# EAGLE design Sifteo Thundercracker Buddy Dev - 0.2 (EAGLE 5.11)
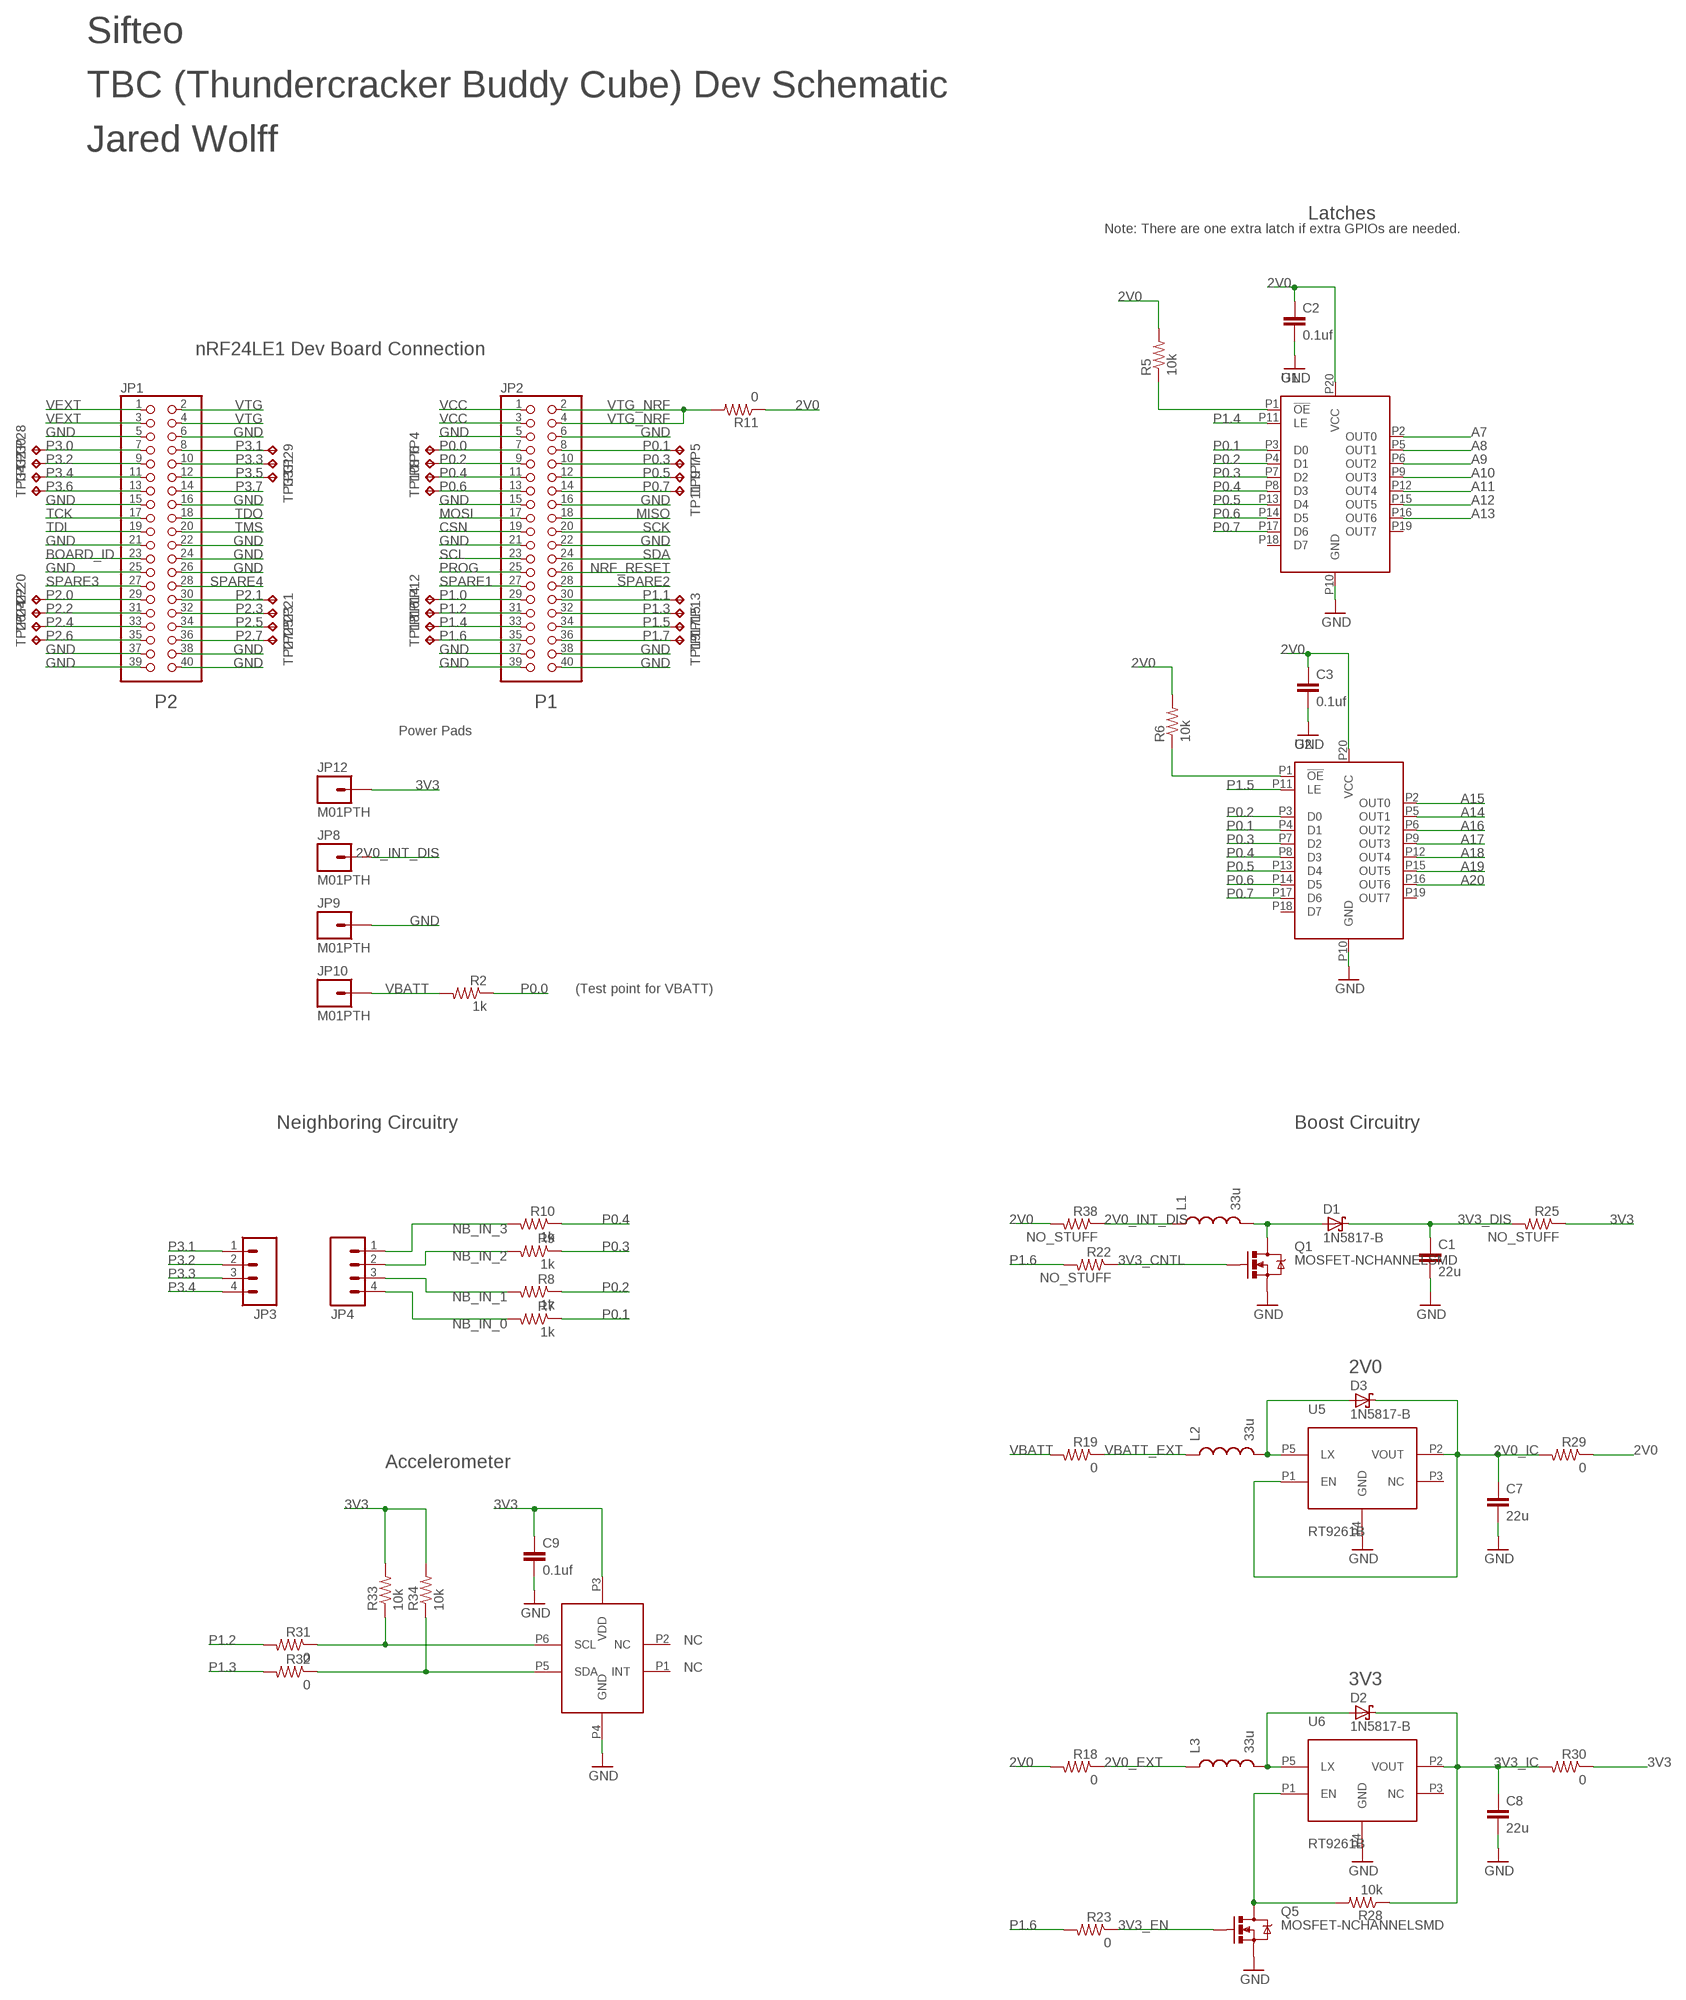
[diagram p0: schematic, sheet 1, part 1 of 2]
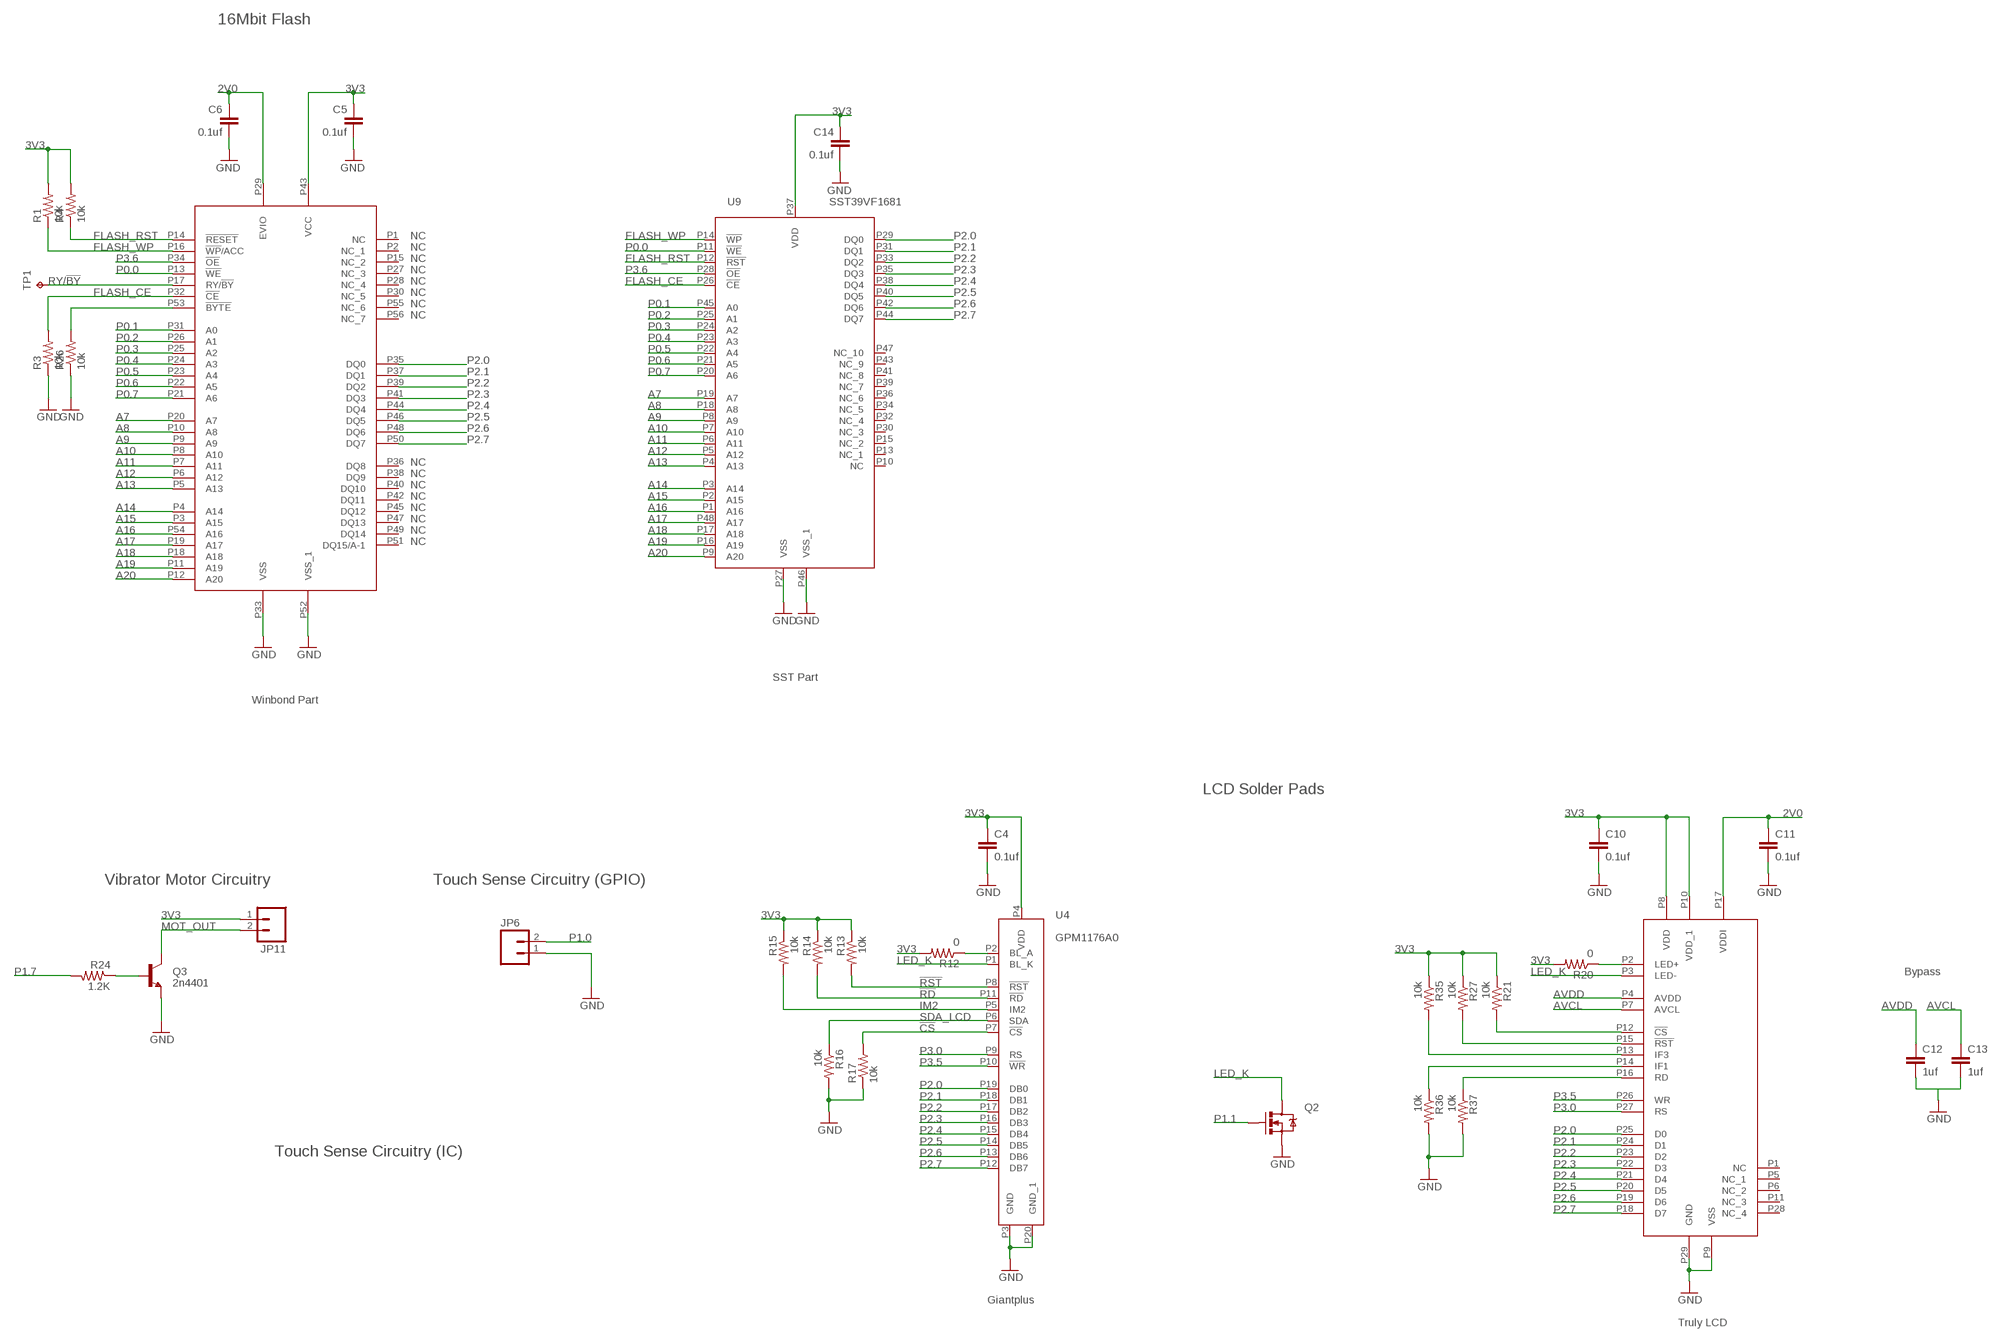
[diagram p1: schematic, sheet 1, part 2 of 2]

## Parts
C1  22u  CAP0603-CAP  [0603-CAP]
C2  0.1uf  CAP0402-CAP  [0402-CAP]
C3  0.1uf  CAP0402-CAP  [0402-CAP]
C4  0.1uf  CAP0402-CAP  [0402-CAP]
C5  0.1uf  CAP0402-CAP  [0402-CAP]
C6  0.1uf  CAP0402-CAP  [0402-CAP]
C7  22u  CAP0603-CAP  [0603-CAP]
C8  22u  CAP0603-CAP  [0603-CAP]
C9  0.1uf  CAP0402-CAP  [0402-CAP]
C10  0.1uf  CAP0402-CAP  [0402-CAP]
C11  0.1uf  CAP0402-CAP  [0402-CAP]
C12  1uf  CAP0402-CAP  [0402-CAP]
C13  1uf  CAP0402-CAP  [0402-CAP]
C14  0.1uf  CAP0402-CAP  [0402-CAP]
D1  1N5817-B  [DO41-7.6]
D2  1N5817-B  [DO41-7.6]
D3  1N5817-B  [DO41-7.6]
JP1  PINHD-2X20  [2X20]
JP2  PINHD-2X20  [2X20]
JP3  M04PTH  [1X04]
JP4  M04PTH  [1X04]
JP6  M02PTH  [1X02]
JP8  M01PTH  [1X01]
JP9  M01PTH  [1X01]
JP10  M01PTH  [1X01]
JP11  M02PTH  [1X02]
JP12  M01PTH  [1X01]
L1  33u  INDUCTOR1206H*  [INDUCTOR-1206]
L2  33u  INDUCTOR1206H*  [INDUCTOR-1206]
L3  33u  INDUCTOR1206H*  [INDUCTOR-1206]
Q1  MOSFET-NCHANNELSMD  [SOT23-3]
Q2  MOSFET-NCHANNELSMD  [SOT23-3]
Q3  2n4401  TRANSISTOR_NPNSOT23  [SOT23]
Q5  MOSFET-NCHANNELSMD  [SOT23-3]
R1  10k  RESISTOR0603-RES  [0603-RES]
R2  1k  RESISTOR0603-RES  [0603-RES]
R3  10k  RESISTOR0603-RES  [0603-RES]
R4  10k  RESISTOR0603-RES  [0603-RES]
R5  10k  RESISTOR0603-RES  [0603-RES]
R6  10k  RESISTOR0603-RES  [0603-RES]
R7  1k  RESISTOR0603-RES  [0603-RES]
R8  1k  RESISTOR0603-RES  [0603-RES]
R9  1k  RESISTOR0603-RES  [0603-RES]
R10  1k  RESISTOR0603-RES  [0603-RES]
R11  0  RESISTOR0603-RES  [0603-RES]
R12  0  RESISTOR0603-RES  [0603-RES]
R13  10k  RESISTOR0603-RES  [0603-RES]
R14  10k  RESISTOR0603-RES  [0603-RES]
R15  10k  RESISTOR0603-RES  [0603-RES]
R16  10k  RESISTOR0603-RES  [0603-RES]
R17  10k  RESISTOR0603-RES  [0603-RES]
R18  0  RESISTOR0603-RES  [0603-RES]
R19  0  RESISTOR0603-RES  [0603-RES]
R20  0  RESISTOR0603-RES  [0603-RES]
R21  10k  RESISTOR0603-RES  [0603-RES]
R22  NO_STUFF  RESISTOR0603-RES  [0603-RES]
R23  0  RESISTOR0603-RES  [0603-RES]
R24  1.2K  RESISTOR0603-RES  [0603-RES]
R25  NO_STUFF  RESISTOR0603-RES  [0603-RES]
R26  10k  RESISTOR0603-RES  [0603-RES]
R27  10k  RESISTOR0603-RES  [0603-RES]
R28  10k  RESISTOR0603-RES  [0603-RES]
R29  0  RESISTOR0603-RES  [0603-RES]
R30  0  RESISTOR0603-RES  [0603-RES]
R31  0  RESISTOR0603-RES  [0603-RES]
R32  0  RESISTOR0603-RES  [0603-RES]
R33  10k  RESISTOR0603-RES  [0603-RES]
R34  10k  RESISTOR0603-RES  [0603-RES]
R35  10k  RESISTOR0603-RES  [0603-RES]
R36  10k  RESISTOR0603-RES  [0603-RES]
R37  10k  RESISTOR0603-RES  [0603-RES]
R38  NO_STUFF  RESISTOR0603-RES  [0603-RES]
TP1  TPTP15R  [TP15R]
TP4  TPTP15R  [TP15R]
TP5  TPTP15R  [TP15R]
TP6  TPTP15R  [TP15R]
TP7  TPTP15R  [TP15R]
TP8  TPTP15R  [TP15R]
TP9  TPTP15R  [TP15R]
TP10  TPTP15R  [TP15R]
TP11  TPTP15R  [TP15R]
TP12  TPTP15R  [TP15R]
TP13  TPTP15R  [TP15R]
TP14  TPTP15R  [TP15R]
TP15  TPTP15R  [TP15R]
TP16  TPTP15R  [TP15R]
TP17  TPTP15R  [TP15R]
TP18  TPTP15R  [TP15R]
TP19  TPTP15R  [TP15R]
TP20  TPTP15R  [TP15R]
TP21  TPTP15R  [TP15R]
TP22  TPTP15R  [TP15R]
TP23  TPTP15R  [TP15R]
TP24  TPTP15R  [TP15R]
TP25  TPTP15R  [TP15R]
TP26  TPTP15R  [TP15R]
TP27  TPTP15R  [TP15R]
TP28  TPTP15R  [TP15R]
TP29  TPTP15R  [TP15R]
TP30  TPTP15R  [TP15R]
TP31  TPTP15R  [TP15R]
TP32  TPTP15R  [TP15R]
TP33  TPTP15R  [TP15R]
TP34  TPTP15R  [TP15R]
U1  74LCX373  [20-TSSOP-4.4MM]
U2  74LCX373  [20-TSSOP-4.4MM]
U3  W29GL032C-56  [56-TSOP-14X20MM]
U4  GPM1176A0  [20-LCD-FLEX]
U5  RT9261B  [SOT-23-5]
U6  RT9261B  [SOT-23-5]
U7  DTOS-V005  [LCC6]
U8  TFT128128-102-E  [28-LCD-FLEX]
U9  SST39VF1681  [48-TSOP-12X20MM]

## Nets
2V0: C2.1 C3.1 C6.1 C11.1 R5.2 R6.2 R11.1 R18.2 R29.1 R38.2 U1.P20(VCC) U2.P20(VCC) U3.P29(EVIO) U8.P17(VDDI)
2V0_EXT: L3.P$1 R18.1
2V0_IC: C7.1 D3.C R29.2 U5.P1(EN) U5.P2(VOUT)
2V0_INT_DIS: JP8.1 L1.P$1 R38.1
3V3: C4.1 C5.1 C9.1 C10.1 C14.1 JP11.1 JP12.1 R1.2 R4.2 R12.2 R13.1 R14.1 R15.1 R20.2 R21.1 R25.1 R27.1 R30.1 R33.2 R34.2 R35.1 U3.P43(VCC) U4.P4(VDD) U7.P3(VDD) U8.P8(VDD) U8.P10(VDD_1) U9.P37(VDD)
3V3_CNTL: Q1.1(G) R22.1
3V3_DIS: C1.1 D1.C R25.2
3V3_EN: Q5.1(G) R23.1
3V3_IC: C8.1 D2.C R28.1 R30.2 U6.P2(VOUT)
!CS: R17.2 U4.P7(!CS)
!RD: R14.2 U4.P11(!RD)
!RST: R13.2 U4.P8(!RST)
A7: U1.P2(OUT0) U3.P20(A7) U9.P19(A7)
A8: U1.P5(OUT1) U3.P10(A8) U9.P18(A8)
A9: U1.P6(OUT2) U3.P9(A9) U9.P8(A9)
A10: U1.P9(OUT3) U3.P8(A10) U9.P7(A10)
A11: U1.P12(OUT4) U3.P7(A11) U9.P6(A11)
A12: U1.P15(OUT5) U3.P6(A12) U9.P5(A12)
A13: U1.P16(OUT6) U3.P5(A13) U9.P4(A13)
A14: U2.P5(OUT1) U3.P4(A14) U9.P3(A14)
A15: U2.P2(OUT0) U3.P3(A15) U9.P2(A15)
A16: U2.P6(OUT2) U3.P54(A16) U9.P1(A16)
A17: U2.P9(OUT3) U3.P19(A17) U9.P48(A17)
A18: U2.P12(OUT4) U3.P18(A18) U9.P17(A18)
A19: U2.P15(OUT5) U3.P11(A19) U9.P16(A19)
A20: U2.P16(OUT6) U3.P12(A20) U9.P9(A20)
AVCL: C13.1 U8.P7(AVCL)
AVDD: C12.1 U8.P4(AVDD)
BOARD_ID: JP1.23
CSN: JP2.19
FLASH_CE: R3.2 U3.P32(!CE) U9.P26(!CE)
FLASH_RST: R4.1 U3.P14(!RESET) U9.P12(!RST)
FLASH_WP: R1.1 U3.P16(!WP!/ACC) U9.P14(!WP)
GND: C1.2 C2.2 C3.2 C4.2 C5.2 C6.2 C7.2 C8.2 C9.2 C10.2 C11.2 C12.2 C13.2 C14.2 JP1.5 JP1.6 JP1.15 JP1.16 JP1.21 JP1.22 JP1.24 JP1.25 JP1.26 JP1.37 JP1.38 JP1.39 JP1.40 JP2.5 JP2.6 JP2.15 JP2.16 JP2.21 JP2.22 JP2.37 JP2.38 JP2.39 JP2.40 JP6.1 JP9.1 Q1.2(S) Q2.2(S) Q3.2(E) Q5.2(S) R3.1 R16.2 R17.1 R26.1 R36.2 R37.2 U1.P10(GND) U2.P10(GND) U3.P33(VSS) U3.P52(VSS_1) U4.P3(GND) U4.P20(GND_1) U5.P4(GND) U6.P4(GND) U7.P4(GND) U8.P9(VSS) U8.P29(GND) U9.P27(VSS) U9.P46(VSS_1)
IM2: R15.2 U4.P5(IM2)
LED_K: Q2.3(D) U4.P1(BL_K) U8.P3(LED-)
MISO: JP2.18
MOSI: JP2.17
MOT_OUT: JP11.2 Q3.3(C)
N$3: R26.2 U3.P53(!BYTE)
N$5: Q3.1(B) R24.1
N$6: R5.1 U1.P1(!OE)
N$7: R21.2 U8.P12(!CS)
N$8: D3.A L2.P$2 U5.P5(LX)
N$9: R6.1 U2.P1(!OE)
N$10: D1.A L1.P$2 Q1.3(D)
N$11: R12.1 U4.P2(BL_A)
N$12: D2.A L3.P$2 U6.P5(LX)
N$13: Q5.3(D) R28.2 U6.P1(EN)
N$14: R32.1 R34.1 U7.P5(SDA)
N$15: R20.1 U8.P2(LED+)
N$16: R31.1 R33.1 U7.P6(SCL)
N$19: R27.2 U8.P15(!RST)
N$20: R35.2 U8.P13(IF3)
N$21: R36.1 U8.P14(IF1)
N$22: R37.1 U8.P16(RD)
NB_IN_0: JP4.4 R7.2
NB_IN_1: JP4.3 R8.2
NB_IN_2: JP4.2 R9.2
NB_IN_3: JP4.1 R10.2
NRF_RESET: JP2.26
P0.0: JP2.7 R2.1 TP4.TP U3.P13(!WE) U9.P11(!WE)
P0.1: JP2.8 R7.1 TP5.TP U1.P3(D0) U2.P4(D1) U3.P31(A0) U9.P45(A0)
P0.2: JP2.9 R8.1 TP6.TP U1.P4(D1) U2.P3(D0) U3.P26(A1) U9.P25(A1)
P0.3: JP2.10 R9.1 TP7.TP U1.P7(D2) U2.P7(D2) U3.P25(A2) U9.P24(A2)
P0.4: JP2.11 R10.1 TP8.TP U1.P8(D3) U2.P8(D3) U3.P24(A3) U9.P23(A3)
P0.5: JP2.12 TP9.TP U1.P13(D4) U2.P13(D4) U3.P23(A4) U9.P22(A4)
P0.6: JP2.13 TP10.TP U1.P14(D5) U2.P14(D5) U3.P22(A5) U9.P21(A5)
P0.7: JP2.14 TP11.TP U1.P17(D6) U2.P17(D6) U3.P21(A6) U9.P20(A6)
P1.0: JP2.29 JP6.2 TP12.TP
P1.1: JP2.30 Q2.1(G) TP13.TP
P1.2: JP2.31 R31.2 TP14.TP
P1.3: JP2.32 R32.2 TP15.TP
P1.4: JP2.33 TP16.TP U1.P11(LE)
P1.5: JP2.34 TP17.TP U2.P11(LE)
P1.6: JP2.35 R22.2 R23.2 TP18.TP
P1.7: JP2.36 R24.2 TP19.TP
P2.0: JP1.29 TP20.TP U3.P35(DQ0) U4.P19(DB0) U8.P25(D0) U9.P29(DQ0)
P2.1: JP1.30 TP21.TP U3.P37(DQ1) U4.P18(DB1) U8.P24(D1) U9.P31(DQ1)
P2.2: JP1.31 TP22.TP U3.P39(DQ2) U4.P17(DB2) U8.P23(D2) U9.P33(DQ2)
P2.3: JP1.32 TP23.TP U3.P41(DQ3) U4.P16(DB3) U8.P22(D3) U9.P35(DQ3)
P2.4: JP1.33 TP24.TP U3.P44(DQ4) U4.P15(DB4) U8.P21(D4) U9.P38(DQ4)
P2.5: JP1.34 TP25.TP U3.P46(DQ5) U4.P14(DB5) U8.P20(D5) U9.P40(DQ5)
P2.6: JP1.35 TP26.TP U3.P48(DQ6) U4.P13(DB6) U8.P19(D6) U9.P42(DQ6)
P2.7: JP1.36 TP27.TP U3.P50(DQ7) U4.P12(DB7) U8.P18(D7) U9.P44(DQ7)
P3.0: JP1.7 TP28.TP U4.P9(RS) U8.P27(RS)
P3.1: JP1.8 JP3.1 TP29.TP
P3.2: JP1.9 JP3.2 TP30.TP
P3.3: JP1.10 JP3.3 TP31.TP
P3.4: JP1.11 JP3.4 TP32.TP
P3.5: JP1.12 TP33.TP U4.P10(!WR) U8.P26(WR)
P3.6: JP1.13 TP34.TP U3.P34(!OE) U9.P28(!OE)
P3.7: JP1.14
PROG: JP2.25
RY/!BY: TP1.TP U3.P17(RY/!BY)
SCK: JP2.20
SCL: JP2.23
SDA: JP2.24
SDA_LCD: R16.1 U4.P6(SDA)
SPARE1: JP2.27
SPARE2: JP2.28
SPARE3: JP1.27
SPARE4: JP1.28
TCK: JP1.17
TDI: JP1.19
TDO: JP1.18
TMS: JP1.20
VBATT: JP10.1 R2.2 R19.2
VBATT_EXT: L2.P$1 R19.1
VCC: JP2.1 JP2.3
VEXT: JP1.1 JP1.3
VTG: JP1.2 JP1.4
VTG_NRF: JP2.2 JP2.4 R11.2
Unconnected: U1.P18(D7) U1.P19(OUT7) U2.P18(D7) U2.P19(OUT7) U3.P1(NC) U3.P2(NC_1) U3.P15(NC_2) U3.P27(NC_3) U3.P28(NC_4) U3.P30(NC_5) U3.P36(DQ8) U3.P38(DQ9) U3.P40(DQ10) U3.P42(DQ11) U3.P45(DQ12) U3.P47(DQ13) U3.P49(DQ14) U3.P51(DQ15/A-1) U3.P55(NC_6) U3.P56(NC_7) U5.P3(NC) U6.P3(NC) U7.P1(INT) U7.P2(NC) U8.P1(NC) U8.P5(NC_1) U8.P6(NC_2) U8.P11(NC_3) U8.P28(NC_4) U9.P10(NC) U9.P13(NC_1) U9.P15(NC_2) U9.P30(NC_3) U9.P32(NC_4) U9.P34(NC_5) U9.P36(NC_6) U9.P39(NC_7) U9.P41(NC_8) U9.P43(NC_9) U9.P47(NC_10)

## Notes on the sheet
- Sifteo
- TBC (Thundercracker Buddy Cube) Dev Schematic
- Jared Wolff
- Latches | 16Mbit Flash
- Note: There are one extra latch if extra GPIOs are needed.
- nRF24LE1 Dev Board Connection
- NC
- NC
- NC
- NC
- NC
- NC
- NC
- NC
- P2 | P1
- Power Pads
- NC
- NC
- NC
- NC
- NC
- NC
- NC
- NC
- (Test point for VBATT)
- SST Part
- Winbond Part
- Neighboring Circuitry | Boost Circuitry
- LCD Solder Pads
- Vibrator Motor Circuitry | Touch Sense Circuitry (GPIO)
- Bypass
- 2V0
- Accelerometer
- Touch Sense Circuitry (IC)
- NC
- NC
- 3V3
- Giantplus
- Truly LCD

## Library data of the parts
C1-C14 = SparkFun:CAP: Capacitor Standard 0603 ceramic capacitor, and 0.1" leaded capacitor.
D1-D3 = diode:1N581*: 1.0A SCHOTTKY BARRIER RECTIFIER Source: http://www.diodes.com/datasheets/ds23001.pdf
JP1 JP2 = pinhead:PINHD-2X20: PIN HEADER
JP3 JP4 = SparkFun:M04: Header 4 Standard 4-pin 0.1" header. Use with straight break away headers (SKU : PRT-00116), right angle break away headers (PRT-00553), swiss pins (PRT-00743), machine pins (PRT-00117), and female headers (PRT-00115). Molex polarized connector foot print use with SKU : PRT-08231 with associated crimp pins and housings. 1MM SMD Version SKU: PRT-10208
JP6 JP11 = SparkFun:M02: Header 2 Standard 2-pin 0.1" header. Use with straight break away headers (SKU : PRT-00116), right angle break away headers (PRT-00553), swiss pins (PRT-00743), machine pins (PRT-00117), and female headers (PRT-00115). Molex polarized connector foot print use with SKU : PRT-08233 with associated crimp pins and housings.
JP8-JP10 JP12 = SparkFun:M01: Header 1 Standard 1-pin 0.1" header. Use with straight break away headers (SKU : PRT-00116), right angle break away headers (PRT-00553), swiss pins (PRT-00743), machine pins (PRT-00117), and female headers (PRT-00115).
L1-L3 = SparkFun:INDUCTOR: Inductors Basic Inductor/Choke - 0603 and 1206. Footprints are not proven and vary greatly between part numbers.
Q1 Q2 Q5 = SparkFun:MOSFET-NCHANNEL
Q3 = SparkFun:TRANSISTOR_NPN: Transistor NPN BJT configuration in SOT23 package. MMBT2222 is the common NPN we use. Double check BCE configuration again layout.
R1-R38 = SparkFun:RESISTOR: Resistor Basic schematic elements and footprints for 0603, 1206, and PTH resistors.
TP1 TP4-TP34 = testpad:TP: Test pad
U1 U2 = Sifteo:74LCX373: All prices are in US dollars. Digi-Key Part Number 74LCX373MTCXCT-ND Price Break Unit Price Extended Price 1 0.70000 0.70 25 0.48920 12.23 100 0.41940 41.94 250 0.36224 90.56 500 0.31140 155.70 1,000 0.24149 241.49 Quantity Available 7,769 Note <http://ordering.digikey.com/Help.aspx?id=Quantity%20Available%20Note&site=US&lang=EN> Manufacturer Fairchild Semiconductor <http://digikey.com/Suppliers/us/Fairchild-Semiconductor.page?lang=EN> Manufacturer Part Number 74LCX373MTCX Description IC TRANSPARENT LATCH OCT 20TSSOP Lead Free Status / RoHS Status Lead free / RoHS Compliant Datasheets 74LCX373 <http://www.fairchildsemi.com/ds/74/74LCX373.pdf> Product Photos 20-TSSOP Pkg <http://media.digikey.com/photos/Fairchild%20Semi%20Photos/261-20-TSSOP.jpg> 20-TSSOP <http://media.digikey.com/Renders/~~Pkg.Case%20or%20Series/20-TSSOP%20(0.173,%204.40mm%20Width).jpg> Standard Package <http://dkc1.digikey.com/US/EN/help/help14.html> 1 Category Integrated Circuits (ICs) Family Logic - Latches Series 74LCX Logic Type D-Type Transparent Latch Circuit 8:8 Output Type Tri-State Voltage - Supply 2 V ~ 3.6 V Independent Circuits 1 Delay Time - Propagation 1.5ns Current - Output High, Low 24mA, 24mA Operating Temperature -40°C ~ 85°C Mounting Type Surface Mount Package / Case 20-TSSOP (0.173", 4.40mm Width) Supplier Device Package 20-TSSOP Packaging <http://dkc1.digikey.com/US/EN/help/help14.html> Cut Tape (CT) Catalog Page 1103 (US2011 Interactive) <http://onlinecatalog.digikey.com/?pagelabel=1103> 1103 (US2011 PDF) <http://dkc3.digikey.com/PDF/US2011/P1103.pdf> Other Names 74LCX373MTCXCT
U3 = Sifteo:W29GL032C-56: Winbond W29GL032C General Description: The W29GL032C Parallel Flash memory provides a storage solution for embedded system applications that require better performance, lower power consumption and higher density. This device has a random access speed of 70ns and a fast page access speed of 25ns, as well as significantly faster program and erase times than the products comparable on the market today. The W29GL032C also offers special features such as Compatible Manufacturer ID that makes the device industry standard compatible without the need to change firmware.
U4 = Sifteo:GPM1176A0: Giantplus Technology GPM1176A0 1.52 Strip TFT LCD Module ROHS Compliant Description: The GPM1176A0 model is a Color TFT LCD supplied by Giantplus. This main Module has an 1.52 inch diagonally measured active display area with 128 X RGB X 128 resolution. Each pixel is divided into Red, Green and Blue sub-pixels and dots which are arranged in vertical stripes. LCD color is determined with Dithering 262K/65K/4K Color signal for each pixel. The GPM1176A0 has been designed to apply the interface method that enables low power, high speed, and high contrast. The GPM1176A0 is intended to support applications where thin thickness, wide viewing angle, low power are critical factors and graphic displays are important.
U5 U6 = Sifteo:RT9261B: RT9261B General Description The RT9261B Series are VFM Step-up DC/DC converter ICs with ultra low supply current by CMOS process and suitable for use with battery-powered instruments. The RT9261B IC consists of an oscillator, a VFM control circuit, a driver transistor (LX switch), a reference voltage unit, an error amplifier, resistors for voltage detection, and a LX switch protection circuit. A low ripple and high efficiency step-up DC/DC converter can be constructed with the RT9261B IC and only three external components. The EN pin enables the circuit to set the standby supply current at a maximum of 0.5?A.<
U7 = Sifteo:DTOS-V005
U8 = Sifteo:TFT128128-102-E: Truly LCD Module Model Number: TFT128128-102-E
U9 = Sifteo:SST39VF1681: All prices are in US dollars. Digi-Key Part Number SST39VF1681-70-4C-EKE-ND Price Break Unit Price Extended Price 1 3.56000 3.56 10 2.97000 29.70 25 2.82000 70.50 100 2.69000 269.00 Quantity Available 105 Manufacturer Microchip Technology <http://digikey.com/Suppliers/us/Microchip-Technology.page?lang=EN> Manufacturer Part Number SST39VF1681-70-4C-EKE Description IC FLASH MPF 16MBIT 70NS 48TSOP Lead Free Status / RoHS Status Lead free / RoHS Compliant Datasheets SST39 Series Brochure <http://ww1.microchip.com/downloads/en/DeviceDoc/01360A.pdf> SST39VF1681, 1682 <http://ww1.microchip.com/downloads/en/DeviceDoc/25040A.pdf> Product Photos 48-TSOP <http://media.digikey.com/Renders/Microchip%20Tech%20Renders/48-TSOP.jpg> Featured Product SST Serial and Parallel Flash Memory <http://www.digikey.com/product-highlights/us/en/microchip-sst-serial-parallel-flash-memory/4> Standard Package <http://dkc1.digikey.com/US/EN/help/help14.html> 96 Category Integrated Circuits (ICs) Family Memory Series - Format - Memory FLASH Memory Type FLASH Memory Size 16M (2M x 8) Speed 70ns Interface Parallel Voltage - Supply 2.7 V ~ 3.6 V Operating Temperature 0°C ~ 70°C Package / Case 48-TFSOP (0.472", 12.00mm Width) Supplier Device Package 48-TSOP Packaging <http://dkc1.digikey.com/US/EN/help/help14.html> Tray Catalog Page 1233 (US2011 Interactive) <http://onlinecatalog.digikey.com/?pagelabel=1233> 1233 (US2011 PDF) <http://dkc3.digikey.com/PDF/US2011/P1233.pdf>

## Board
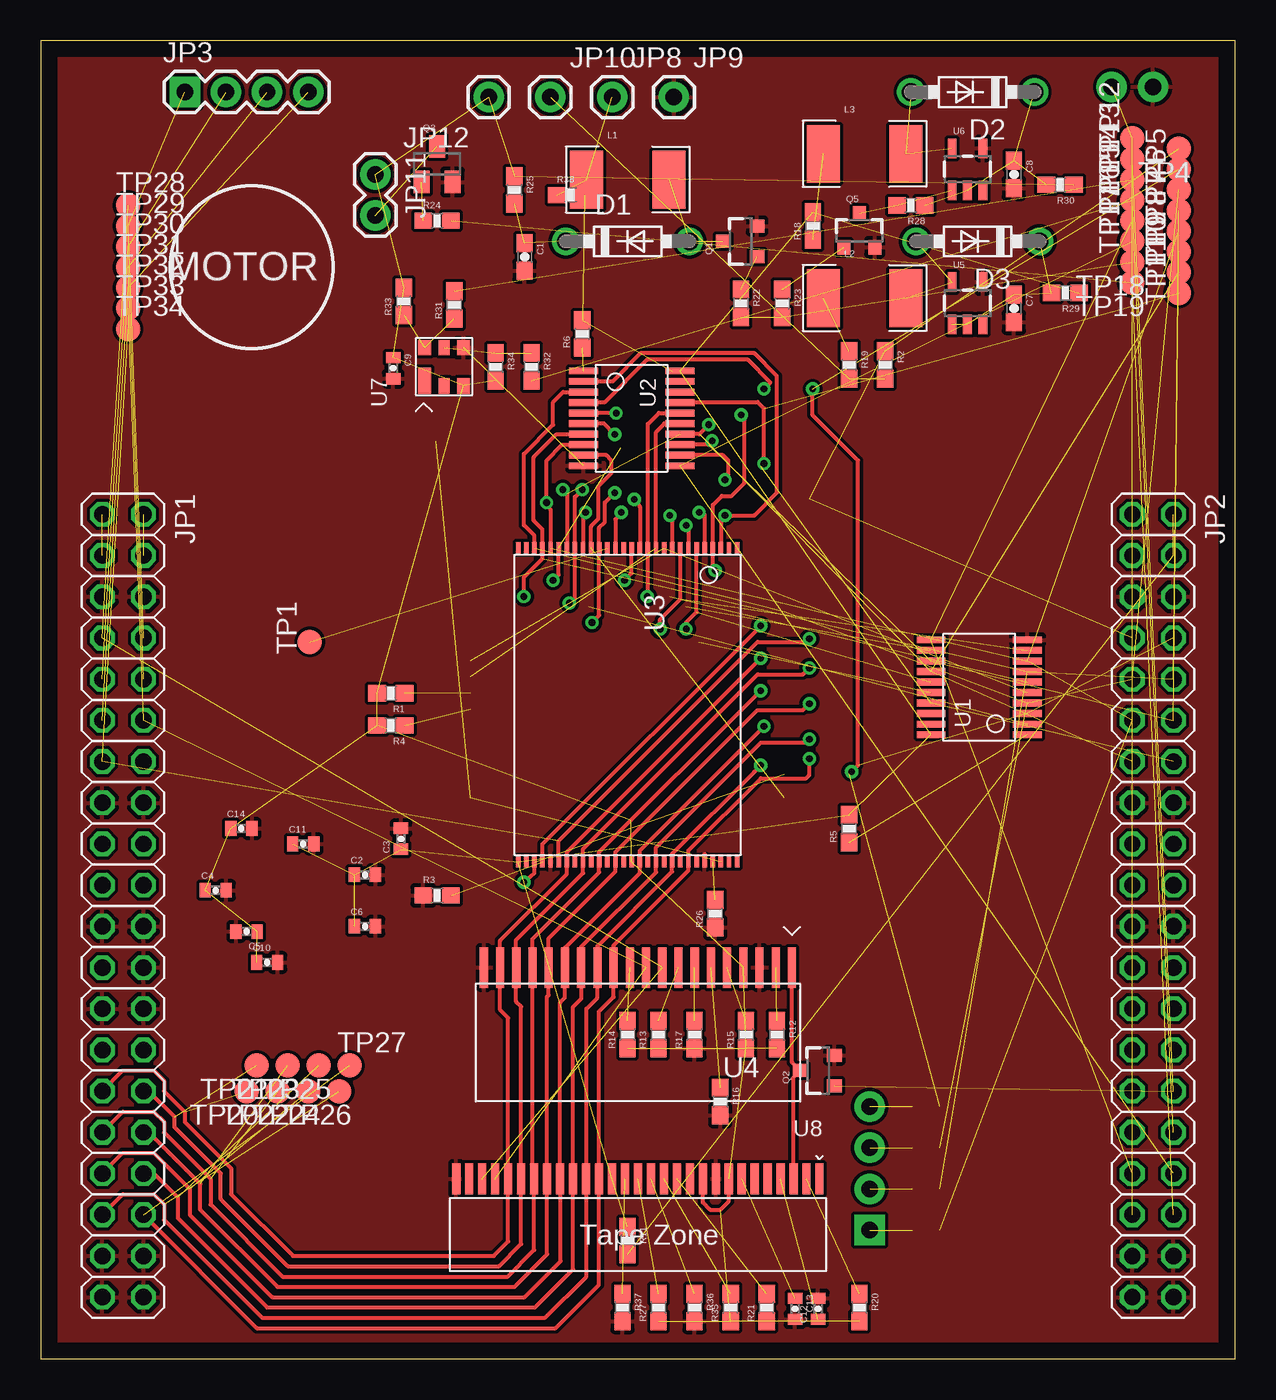
[diagram p2: board, top side]
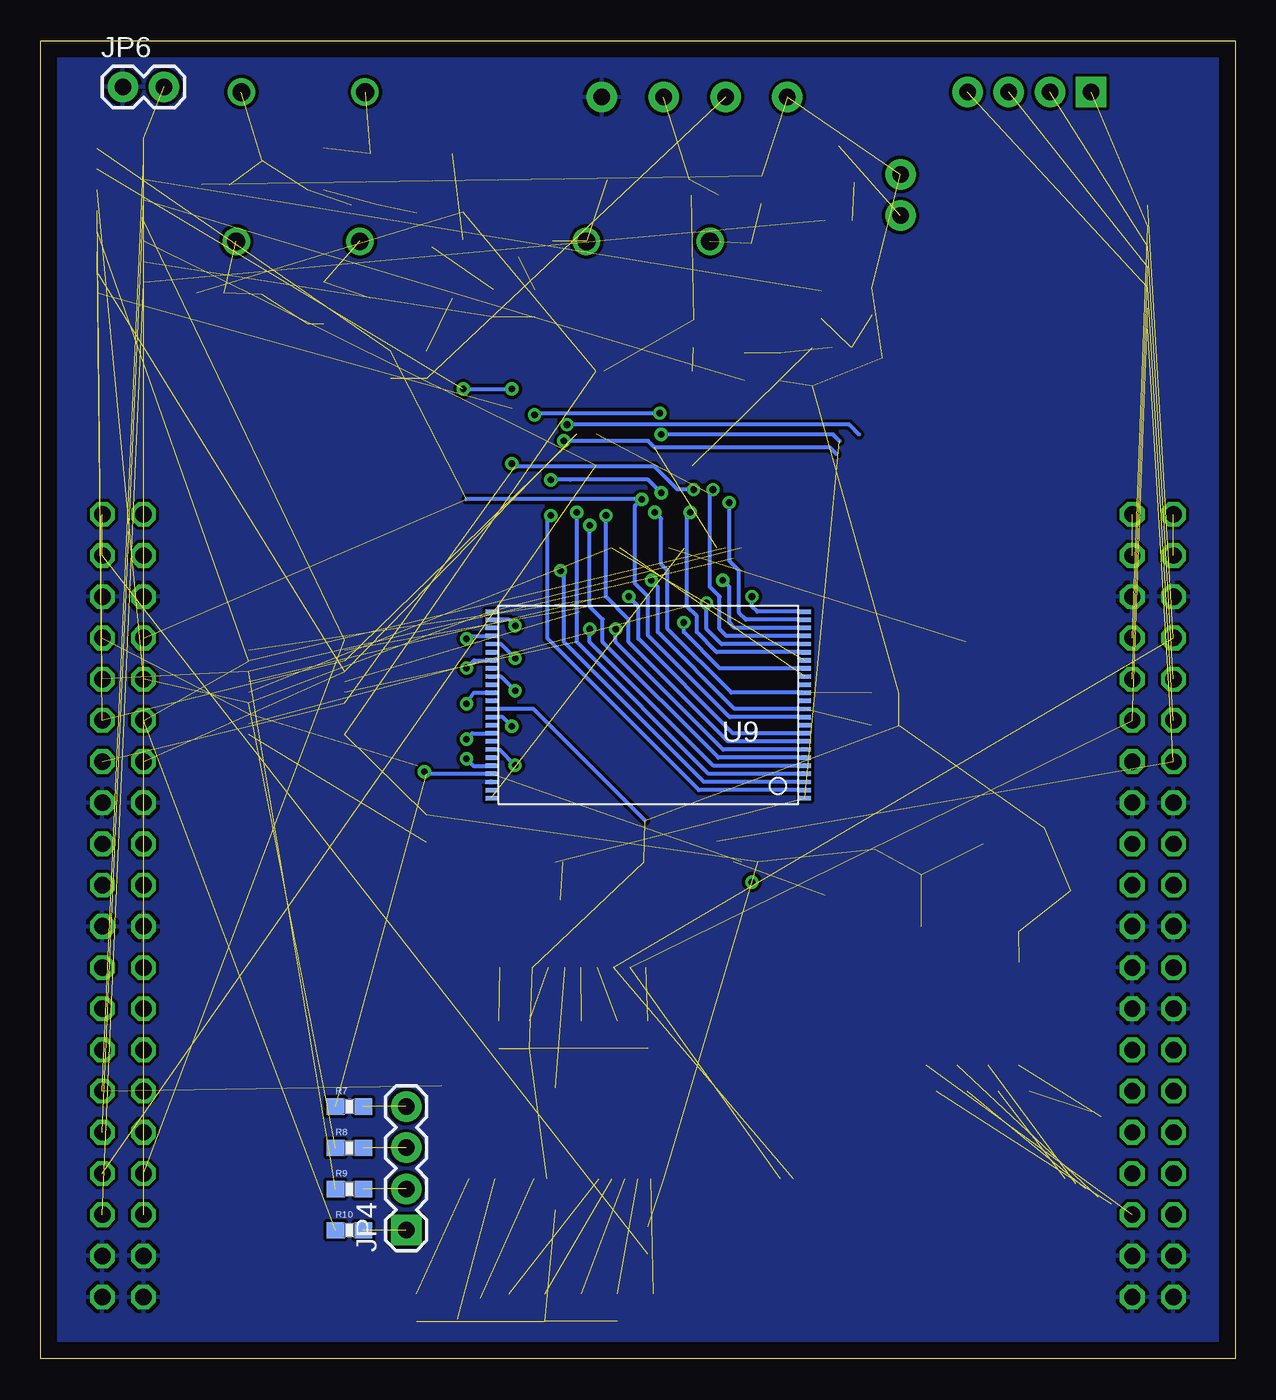
[diagram p3: board, bottom side, seen from below]

Size 73.66 x 81.28 mm. Coordinates in mm from the lower left corner, seen from the top.
Outline: 0,0 73.66,0 73.66,81.28 0,81.28 0,0
Copper layers (1*16): Top 0.035mm / dielectric 1.5mm / Bottom 0.035mm
Design rules "default *": minimum track width 8mil, minimum drill 16mil, track to track 8mil, track to pad 8mil, pad to pad 8mil, via to via 8mil, smd to smd 8mil, copper to edge 40mil, drill to drill 8mil, minimum pad ring 10mil, minimum via ring 8mil, stop-mask expansion 4mil, vias tented up to drill 0mil, thermal gap 10mil

### Footprints (pad centres in the part's own frame; a part is rotated, then mirrored left to right if it is on the bottom)
0603-CAP = smd 1.1 x 1: 1 -0.85,0; 2 0.85,0
0402-CAP = smd 0.7 x 0.9: 1 -0.65,0; 2 0.65,0
DO41-7.6 = drill 1.1 pad 1.7 round: A 3.81,0; C -3.81,0
2X20 = drill 1.016 octagon: 1 -24.13,-1.27; 2 -24.13,1.27; 3 -21.59,-1.27; 4 -21.59,1.27; 5 -19.05,-1.27; 6 -19.05,1.27; 7 -16.51,-1.27; 8 -16.51,1.27; 9 -13.97,-1.27; 10 -13.97,1.27; 11 -11.43,-1.27; 12 -11.43,1.27; 13 -8.89,-1.27; 14 -8.89,1.27; 15 -6.35,-1.27; 16 -6.35,1.27; 17 -3.81,-1.27; 18 -3.81,1.27; 19 -1.27,-1.27; 20 -1.27,1.27; 21 1.27,-1.27; 22 1.27,1.27; 23 3.81,-1.27; 24 3.81,1.27; 25 6.35,-1.27; 26 6.35,1.27; 27 8.89,-1.27; 28 8.89,1.27; 29 11.43,-1.27; 30 11.43,1.27; 31 13.97,-1.27; 32 13.97,1.27; 33 16.51,-1.27; 34 16.51,1.27; 35 19.05,-1.27; 36 19.05,1.27; 37 21.59,-1.27; 38 21.59,1.27; 39 24.13,-1.27; 40 24.13,1.27
1X04 = drill 1.016 pad 1.88 square: 1 0,0 | drill 1.016 pad 1.88 round: 2 2.54,0; 3 5.08,0; 4 7.62,0
1X02 = drill 1.016 pad 1.88 round: 1 0,0; 2 2.54,0
1X01 = drill 1.016 pad 1.88 round: 1 0,0
INDUCTOR-1206 = smd 2.032 x 3.556: P$1 -2.54,0; P$2 2.54,0
SOT23-3 = smd 0.8 x 0.9: 1 -0.95,-1; 2 0.95,-1; 3 0,1.1
SOT23 = smd 1 x 1.4: 1 -0.95,-1.1; 2 0.95,-1.1; 3 0,1.1
0603-RES = smd 1.1 x 1: 1 -0.85,0; 2 0.85,0
TP15R = smd 1.5 x 1.5: TP 0,0
20-TSSOP-4.4MM = smd 0.42 x 1.78: P1 -2.925,-2.97; P2 -2.275,-2.97; P3 -1.625,-2.97; P4 -0.975,-2.97; P5 -0.325,-2.97; P6 0.325,-2.97; P7 0.975,-2.97; P8 1.625,-2.97; P9 2.275,-2.97; P10 2.925,-2.97; P11 2.925,2.97; P12 2.275,2.97; P13 1.625,2.97; P14 0.975,2.97; P15 0.325,2.97; P16 -0.325,2.97; P17 -0.975,2.97; P18 -1.625,2.97; P19 -2.275,2.97; P20 -2.925,2.97
56-TSOP-14X20MM = smd 0.7 x 0.27: P1 -9.675,6.75; P2 -9.675,6.25; P3 -9.675,5.75; P4 -9.675,5.25; P5 -9.675,4.75; P6 -9.675,4.25; P7 -9.675,3.75; P8 -9.675,3.25; P9 -9.675,2.75; P10 -9.675,2.25; P11 -9.675,1.75; P12 -9.675,1.25; P13 -9.675,0.75; P14 -9.675,0.25; P15 -9.675,-0.25; P16 -9.675,-0.75; P17 -9.675,-1.25; P18 -9.675,-1.75; P19 -9.675,-2.25; P20 -9.675,-2.75; P21 -9.675,-3.25; P22 -9.675,-3.75; P23 -9.675,-4.25; P24 -9.675,-4.75; P25 -9.675,-5.25; P26 -9.675,-5.75; P27 -9.675,-6.25; P28 -9.675,-6.75; P29 9.675,-6.75; P30 9.675,-6.25; P31 9.675,-5.75; P32 9.675,-5.25; P33 9.675,-4.75; P34 9.675,-4.25; P35 9.675,-3.75; P36 9.675,-3.25; P37 9.675,-2.75; P38 9.675,-2.25; P39 9.675,-1.75; P40 9.675,-1.25; P41 9.675,-0.75; P42 9.675,-0.25; P43 9.675,0.25; P44 9.675,0.75; P45 9.675,1.25; P46 9.675,1.75; P47 9.675,2.25; P48 9.675,2.75; P49 9.675,3.25; P50 9.675,3.75; P51 9.675,4.25; P52 9.675,4.75; P53 9.675,5.25; P54 9.675,5.75; P55 9.675,6.25; P56 9.675,6.75
20-LCD-FLEX = smd 0.5 x 2.5: P1 -9.5,0; P2 -8.5,0; P3 -7.5,0; P4 -6.5,0; P5 -5.5,0; P6 -4.5,0; P7 -3.5,0; P8 -2.5,0; P9 -1.5,0; P10 -0.5,0; P11 0.5,0; P12 1.5,0; P13 2.5,0; P14 3.5,0; P15 4.5,0; P16 5.5,0; P17 6.5,0; P18 7.5,0; P19 8.5,0; P20 9.5,0
SOT-23-5 = smd 0.55 x 1.2: P1 -0.95,-1.3; P2 0,-1.3; P3 0.95,-1.3; P4 0.95,1.3; P5 -0.95,1.3
LCC6 = smd 1.6 x 0.8: P1 -0.85,1.2 | smd 0.95 x 0.7: P2 -1.175,0; P5 1.175,0 | smd 0.95 x 0.8: P3 -1.175,-1.2; P4 1.175,-1.2; P6 1.175,1.2
28-LCD-FLEX = smd 0.5 x 1.9: P1 -11.2,0; P2 -10.4,0; P3 -9.6,0; P4 -8.8,0; P5 -8,0; P6 -7.2,0; P7 -6.4,0; P8 -5.6,0; P9 -4.8,0; P10 -4,0; P11 -3.2,0; P12 -2.4,0; P13 -1.6,0; P14 -0.8,0; P15 0,0; P16 0.8,0; P17 1.6,0; P18 2.4,0; P19 3.2,0; P20 4,0; P21 4.8,0; P22 5.6,0; P23 6.4,0; P24 7.2,0; P25 8,0; P26 8.8,0; P27 9.6,0; P28 10.4,0; P29 11.2,0
48-TSOP-12X20MM = smd 0.7 x 0.27: P1 -9.675,5.75; P2 -9.675,5.25; P3 -9.675,4.75; P4 -9.675,4.25; P5 -9.675,3.75; P6 -9.675,3.25; P7 -9.675,2.75; P8 -9.675,2.25; P9 -9.675,1.75; P10 -9.675,1.25; P11 -9.675,0.75; P12 -9.675,0.25; P13 -9.675,-0.25; P14 -9.675,-0.75; P15 -9.675,-1.25; P16 -9.675,-1.75; P17 -9.675,-2.25; P18 -9.675,-2.75; P19 -9.675,-3.25; P20 -9.675,-3.75; P21 -9.675,-4.25; P22 -9.675,-4.75; P23 -9.675,-5.25; P24 -9.675,-5.75; P25 9.675,-5.75; P26 9.675,-5.25; P27 9.675,-4.75; P28 9.675,-4.25; P29 9.675,-3.75; P30 9.675,-3.25; P31 9.675,-2.75; P32 9.675,-2.25; P33 9.675,-1.75; P34 9.675,-1.25; P35 9.675,-0.75; P36 9.675,-0.25; P37 9.675,0.25; P38 9.675,0.75; P39 9.675,1.25; P40 9.675,1.75; P41 9.675,2.25; P42 9.675,2.75; P43 9.675,3.25; P44 9.675,3.75; P45 9.675,4.25; P46 9.675,4.75; P47 9.675,5.25; P48 9.675,5.75

### Placement (x,y rotation side)
C1  29.84,67.94 270 top
C2  20,29.84 0 top
C3  22.23,32.07 90 top
C4  10.79,28.89 0 top
C5  12.7,26.35 180 top
C6  20,26.67 0 top
C7  60.01,64.77 270 top
C8  60.01,73.03 270 top
C9  21.75,61.08 270 top
C10  13.97,24.45 0 top
C11  16.19,31.75 0 top
C12  47.94,3.09 90 top
C13  46.52,3.09 270 top
C14  12.38,32.7 0 top
D1  36.2,68.9 0 top
D2  57.47,78.11 180 top
D3  57.78,68.9 180 top
JP1  5.08,27.94 270 top
JP2  68.58,27.94 270 top
JP3  8.89,78.11 0 top
JP4  51.12,7.94 90 bottom
JP6  68.58,78.42 0 bottom
JP8  35.24,77.79 0 top
JP9  39.05,77.79 0 top
JP10  31.43,77.79 0 top
JP11  20.64,73.03 270 top
JP12  27.62,77.79 180 top
L1  36.2,72.71 0 top
L2  50.8,65.41 0 top
L3  50.8,74.3 0 top
Q1  43.18,68.9 90 top
Q2  47.94,17.78 90 top
Q3  24.45,73.66 0 top
Q5  50.48,69.53 0 top
R1  21.59,41.04 180 top
R2  52.07,61.28 270 top
R3  24.45,28.57 0 top
R4  21.59,39.05 180 top
R5  49.85,32.7 90 top
R6  33.4,63.2 90 top
R7  54.61,15.56 0 bottom
R8  54.61,13.02 0 bottom
R9  54.61,10.48 0 bottom
R10  54.61,7.94 0 bottom
R11  36.2,7.3 270 top
R12  45.4,20 270 top
R13  38.1,20 90 top
R14  36.2,20 90 top
R15  43.5,20 90 top
R16  41.91,15.88 270 top
R17  40.32,20 90 top
R18  47.62,69.85 90 top
R19  49.85,61.28 270 top
R20  50.48,3.17 270 top
R21  44.77,3.17 90 top
R22  43.18,65.09 270 top
R23  45.72,65.09 270 top
R24  24.45,70.17 0 top
R25  29.21,72.07 270 top
R26  41.59,27.46 90 top
R27  38.1,3.17 90 top
R28  53.66,71.12 180 top
R29  63.18,65.72 180 top
R30  62.87,72.39 180 top
R31  25.51,64.98 90 top
R32  30.27,61.17 270 top
R33  22.4,65.2 90 top
R34  28.05,61.17 270 top
R35  42.55,3.17 90 top
R36  40.32,3.17 270 top
R37  35.88,3.17 270 top
R38  32.7,71.75 0 top
TP1  16.6,44.2 90 top
TP4  70.17,74.61 180 top
TP5  70.17,73.34 90 top
TP6  70.17,72.07 90 top
TP7  70.17,70.8 90 top
TP8  70.17,69.53 90 top
TP9  70.17,68.26 90 top
TP10  70.17,66.99 90 top
TP11  70.17,65.72 90 top
TP12  67.31,75.25 90 top
TP13  67.31,73.98 90 top
TP14  67.31,72.71 90 top
TP15  67.31,71.44 90 top
TP16  67.31,70.17 90 top
TP17  67.31,68.9 90 top
TP18  67.31,67.63 180 top
TP19  67.31,66.36 180 top
TP20  12.7,16.51 180 top
TP21  13.34,18.1 180 top
TP22  14.61,16.51 180 top
TP23  15.24,18.1 180 top
TP24  16.51,16.51 180 top
TP25  17.14,18.1 180 top
TP26  18.41,16.51 180 top
TP27  19.05,18.1 0 top
TP28  5.4,71.12 0 top
TP29  5.4,69.85 0 top
TP30  5.4,68.58 0 top
TP31  5.4,67.31 0 top
TP32  5.4,66.04 0 top
TP33  5.4,64.77 0 top
TP34  5.4,63.5 0 top
U1  57.88,41.41 90 top
U2  36.45,57.99 270 top
U3  36.2,40.32 270 top
U4  36.83,24.13 180 top
U5  57.15,65.09 0 top
U6  57.15,73.34 0 top
U7  24.88,61.17 90 top
U8  36.83,11.11 180 top
U9  36.2,40.32 180 bottom

### Tracks (layer width: path | path; a pad name or v marks a point on that pad's centre or on a via)
2V0  (13 unrouted)
  Top 0.25: U2.P20 38.94,60.91
2V0_EXT  (1 unrouted)
2V0_IC  (4 unrouted)
2V0_INT_DIS  (2 unrouted)
3V3  (25 unrouted)
  Top 0.25: U8.P8 42.43,9.73 41.91,9.21 41.27,9.21 40.83,9.65 U8.P10
  Bottom 0.25: U9.P37 43.27,40.07 36.4,33.2
3V3_CNTL  (1 unrouted)
3V3_DIS  (2 unrouted)
3V3_EN  (1 unrouted)
3V3_IC  (4 unrouted)
!CS  (1 unrouted)
!RD  (1 unrouted)
!RST  (1 unrouted)
A7  (via drill 0.41)  (1 unrouted)
  Top 0.25: U3.P20 33.45,52.05 v33.6,52.2
  Bottom 0.25: U9.P19 31.97,43.57 33.2,44.8 33.2,45.8 33.8,46.4 33.8,52 v33.6,52.2
A8  (2 unrouted)
A9  (via drill 0.41)  (1 unrouted)
  Top 0.25: U3.P9 38.95,51.85 v38.8,52
  Bottom 0.25: U9.P8 31.27,38.07 37.4,44.2 37.4,45.6 38.8,47 v38.8,52
A10  (via drill 0.41)  (1 unrouted)
  Top 0.25: v38.2,45 38.2,45.6 39.45,46.84 U3.P8
  Bottom 0.25: U9.P7 31.57,37.57 38.2,44.2 v38.2,45
A11  (via drill 0.41)  (1 unrouted)
  Top 0.25: U3.P7 39.95,51.26 v39.8,51.4
  Bottom 0.25: U9.P6 31.87,37.07 39,44.2 39,45.6 39.8,46.4 v39.8,51.4
A12  (via drill 0.41)  (1 unrouted)
  Top 0.25: U3.P6 40.45,46.05 39.8,45.4 v39.8,45
  Bottom 0.25: U9.P5 32.17,36.57 39.8,44.2 v39.8,45
A13  (via drill 0.41)  (1 unrouted)
  Top 0.25: U3.P5 40.95,52.05 v40.6,52.2
  Bottom 0.25: U9.P4 32.47,36.07 40.6,44.2 v40.6,52.2
A14  (via drill 0.41)
  Top 0.25: v41.6,48.6 41.45,48.76 U3.P4 41.45,52.65 42,53.2 42.6,53.2 43.4,54 43.4,58 v43.2,58.2 | v35.48,58.31 U2.P5
  Bottom 0.25: U9.P3 32.77,35.57 41.4,44.2 41.4,48.4 v41.6,48.6 | v35.48,58.31 43.09,58.31 v43.2,58.2
A15  (via drill 0.41)
  Top 0.25: v42.2,52 42,51.8 | U3.P3 41.95,51.74 v42.2,52 | U2.P2 35.27,60.27 37,62 44,62 45.4,60.6 45.4,53.4 44,52 v42.2,52
  Bottom 0.25: U9.P2 33.07,35.07 42.4,44.4 42.4,51.8 v42.2,52
A16  (via drill 0.41)  (2 unrouted)
  Top 0.25: U2.P6 34.73,57.66 v35.4,57
  Bottom 0.25: v35.4,57 24.8,57 24.4,56.6
A17  (1 unrouted)
  Top 0.25: U2.P9 34.88,55.72 35.2,55.4 35.2,54.6 34.4,53.8 34.4,51.8 33.95,51.34 U3.P19
A18  (via drill 0.41)
  Top 0.25: v34,45.4 34.45,45.84 U3.P18 34.45,51.24 34.8,51.6 34.8,52.8 v35.4,53.4 | U2.P12 42.09,55.72 42.4,55.4 42.4,54.4 v42.2,54.2
  Bottom 0.25: U9.P17 31.77,42.57 34,44.8 v34,45.4 | v35.4,53.4 36.2,54.2 41,54.2 v42.2,54.2
A19  (1 unrouted)
  Top 0.25: U2.P15 38.47,57.66 37.95,57.15 U3.P11
A20  (via drill 0.41)
  Top 0.25: v37.4,47 37.45,47.05 U3.P12 37.45,57.65 38.12,58.31 U2.P16
  Bottom 0.25: U9.P9 30.97,38.57 36.8,44.4 36.8,46.4 v37.4,47
AVCL  (1 unrouted)
AVDD  (1 unrouted)
FLASH_CE  (via drill 0.41)  (1 unrouted)
  Top 0.25: U3.P32 30.95,31.75 v44.4,45.2
  Bottom 0.25: U9.P26 44.77,45.57 v44.4,45.2
FLASH_RST  (via drill 0.41)  (1 unrouted)
  Top 0.25: U3.P14 36.45,48.45 v36,48
  Bottom 0.25: U9.P12 30.87,40.07 35.6,44.8 35.6,47.6 v36,48
FLASH_WP  (via drill 0.41)  (1 unrouted)
  Top 0.25: U3.P16 35.45,51.76 v35.8,52.2
  Bottom 0.25: U9.P14 31.07,41.07 35,45 35,48.6 35.4,49 35.4,51.8 v35.8,52.2
GND  (1 unrouted)
  Top 0.25: U3.P52 40.95,31.1 40.96,31.11
  pour Bottom: 0,0 73.66,0 73.66,81.28 0,81.28
  pour Top: 0,0 0,81.28 73.66,81.28 73.66,0
IM2  (1 unrouted)
LED_K
  Top 0.25: U4.P1 46.33,18.29 Q2.3 46.43,17.37 U8.P3
MOT_OUT  (1 unrouted)
N$3  (1 unrouted)
N$5  (1 unrouted)
N$6  (1 unrouted)
N$7  (1 unrouted)
N$8  (2 unrouted)
N$9  (1 unrouted)
  Top 0.25: U2.P1 33.87,60.91
N$10  (2 unrouted)
N$11  (1 unrouted)
N$12  (2 unrouted)
N$13  (2 unrouted)
N$14  (2 unrouted)
N$15  (1 unrouted)
N$16  (2 unrouted)
N$19  (1 unrouted)
N$20  (1 unrouted)
N$21  (1 unrouted)
N$22  (1 unrouted)
NB_IN_0  (1 unrouted)
NB_IN_1  (1 unrouted)
NB_IN_2  (1 unrouted)
NB_IN_3  (1 unrouted)
P0.0  (via drill 0.41)  (3 unrouted)
  Top 0.25: v36.6,53 36.95,52.55 U3.P13
  Bottom 0.25: U9.P11 31.17,39.57 36.2,44.6 36.2,47 37,47.8 37,52.6 v36.6,53 47.4,53
P0.1  (via drill 0.41)  (5 unrouted)
  Top 0.25: U3.P31 30.45,29.95 v29.8,29.4 | v50,36.2 50.4,36.6 50.4,55.4 47.6,58.2 v47.6,59.8 | U2.P4 34.77,58.97 37.4,61.6 43.6,61.6 45,60.2 v44.6,59.8
  Bottom 0.25: v50,36.2 49.87,36.07 U9.P45 | v47.6,59.8 v44.6,59.8
P0.2  (5 unrouted)
  Top 0.25: U3.P26 30.45,50.76 29.8,51.4 29.8,55.8 31.6,57.6 31.6,59 32.22,59.62 U2.P3
P0.3  (via drill 0.41)  (4 unrouted)
  Top 0.25: v29.8,47 29.8,48.2 30.95,49.34 U3.P25 30.95,51.15 30.4,51.69 30.4,55.6 31.82,57.02 U2.P7
  Bottom 0.25: U9.P24 29.47,46.07 29.8,46.4 v29.8,47
P0.4  (via drill 0.41)  (4 unrouted)
  Top 0.25: 31.43,49.98 U3.P24 31.45,52.35 v31.2,52.8 31.2,55.4 32.16,56.37 U2.P8
  Bottom 0.25: U9.P23 30.17,45.57 30.6,46 30.6,48.6 31.2,49.2 v31.2,52.8
P0.5  (via drill 0.41)  (4 unrouted)
  Top 0.25: v31.6,48 31.95,48.34 U3.P23 | U2.P13 41.16,56.37 v41.4,56.6
  Bottom 0.25: U9.P22 30.87,45.07 31.2,45.4 31.2,47.6 v31.6,48 | v41.4,56.6 36.2,56.6 35.8,56.2 25,56.2 24.6,55.8
P0.6  (via drill 0.41)  (4 unrouted)
  Top 0.25: v32.2,53.6 32.45,53.35 U3.P22 | U2.P14 40.62,57.02 v41.2,57.6
  Bottom 0.25: U9.P21 31.37,44.57 31.8,45 31.8,47 32.4,47.6 32.4,53.4 v32.2,53.6 | v41.2,57.6 23.8,57.6 23.2,57
P0.7  (via drill 0.41)  (3 unrouted)
  Top 0.25: v32.6,46.6 32.95,46.85 U3.P21 32.95,53.15 v33.4,53.6 | v44.6,55.2 44.6,58.6 44.2,59 44.16,58.97 U2.P17
  Bottom 0.25: U9.P20 31.67,44.07 32.6,45 v32.6,46.6 | v33.4,53.6 34.4,53.6 35.8,55 44.4,55 v44.6,55.2
P1.0  (2 unrouted)
P1.1  (2 unrouted)
P1.2  (2 unrouted)
P1.3  (2 unrouted)
P1.4  (2 unrouted)
P1.5  (2 unrouted)
P1.6  (3 unrouted)
P1.7  (2 unrouted)
P2.0  (via drill 0.41)  (1 unrouted)
  Top 0.25: JP1.29 5.08,17.78 6.99,17.78 7.62,17.14 7.62,16.51 8.89,15.24 8.89,14.61 11.75,11.75 11.75,10.16 15.56,6.35 27.94,6.35 28.83,7.24 U8.P25 28.83,21.02 28.33,21.52 U4.P19 28.33,25.79 32.45,29.91 U3.P35 32.45,31.25 44,42.8 v44.4,43.2
  Bottom 0.25: U9.P29 45.27,44.07 v44.4,43.2
P2.1  (via drill 0.41)  (1 unrouted)
  Top 0.25: JP1.30 6.67,16.51 8.26,14.92 8.26,14.29 11.11,11.43 11.11,9.84 15.24,5.71 28.26,5.71 29.63,7.09 U8.P24 29.63,21.73 29.33,22.03 U4.P18 29.33,25.84 33.45,29.95 U3.P37 33.45,31.45 44.2,42.2 47,42.2 v47.4,42.6
  Bottom 0.25: U9.P31 46.93,43.07 v47.4,42.6
P2.2  (via drill 0.41)  (1 unrouted)
  Top 0.25: JP1.31 5.08,15.24 6.99,15.24 7.62,14.61 7.62,13.97 10.48,11.11 10.48,9.53 14.92,5.08 28.79,5.08 30.43,6.72 U8.P23 30.33,11.21 U4.P17 30.33,25.89 34.45,30 U3.P39 34.45,31.25 44.1,40.9 v44.4,41.2
  Bottom 0.25: U9.P33 45.27,42.07 v44.4,41.2
P2.3  (via drill 0.41)  (1 unrouted)
  Top 0.25: JP1.32 6.67,13.97 9.84,10.79 9.84,9.21 14.61,4.45 29.21,4.45 31.23,6.46 U8.P22 31.23,22.34 31.33,22.44 U4.P16 31.33,25.93 35.45,30.05 U3.P41 35.45,31.25 44.2,40 47,40 v47.4,40.4
  Bottom 0.25: U9.P35 46.93,41.07 v47.4,40.4
P2.4  (via drill 0.41)  (1 unrouted)
  Top 0.25: JP1.33 5.08,12.7 6.99,12.7 9.21,10.48 9.21,8.89 14.29,3.81 29.84,3.81 32.07,6.03 32.07,11.07 U8.P21 32.03,21.98 32.33,22.28 U4.P15 32.33,25.34 36.95,29.96 U3.P44 36.95,31.34 44.2,38.6 v44.6,39
  Bottom 0.25: U9.P38 45.17,39.57 v44.6,39
P2.5  (via drill 0.41)  (1 unrouted)
  Top 0.25: JP1.34 6.99,11.43 8.46,9.96 8.46,8.69 13.97,3.17 30.48,3.17 32.83,5.53 U8.P20 32.83,21.72 33.34,22.23 U4.P14 33.33,25.39 37.95,30.01 U3.P46 37.95,31.55 44.4,38 47.2,38 v47.4,38.2
  Bottom 0.25: U9.P40 47.03,38.57 v47.4,38.2
P2.6  (via drill 0.41)  (1 unrouted)
  Top 0.25: JP1.35 5.08,10.16 6.99,10.16 7.62,9.53 7.62,8.57 13.65,2.54 31.11,2.54 33.66,5.08 33.66,11.09 U8.P19 33.66,11.14 33.66,21.59 34.33,22.27 U4.P13 34.33,25.44 38.95,30.05 U3.P48 38.95,31.14 44,36.2 v44.4,36.6
  Bottom 0.25: U9.P42 45.37,37.57 v44.4,36.6
P2.7  (via drill 0.41)  (1 unrouted)
  Top 0.25: JP1.36 13.34,1.91 31.75,1.91 34.43,4.58 U8.P18 34.43,21.41 35.33,22.31 U4.P12 35.33,25.49 39.95,30.1 U3.P50 39.95,31.34 44.4,35.8 47.2,35.8 47.4,36 v47.4,37
  Bottom 0.25: v47.4,37 46.97,36.57 U9.P44
P3.0  (3 unrouted)
P3.1  (2 unrouted)
P3.2  (2 unrouted)
P3.3  (2 unrouted)
P3.4  (2 unrouted)
P3.5  (3 unrouted)
P3.6  (via drill 0.41)  (2 unrouted)
  Top 0.25: U3.P34 31.95,31.95 44.2,44.2 47.2,44.2 v47.4,44.4
  Bottom 0.25: 47.2,44.6 v47.4,44.4 47.23,44.57 U9.P28
RY/!BY  (1 unrouted)
SDA_LCD  (1 unrouted)
VBATT  (2 unrouted)
VBATT_EXT  (1 unrouted)
VCC  (1 unrouted)
VEXT  (1 unrouted)
VTG  (1 unrouted)
VTG_NRF  (2 unrouted)

### Text on the board
tPlace: MOTOR